# EAGLE design DasAltimeter V0.41 (EAGLE 9.5.2)
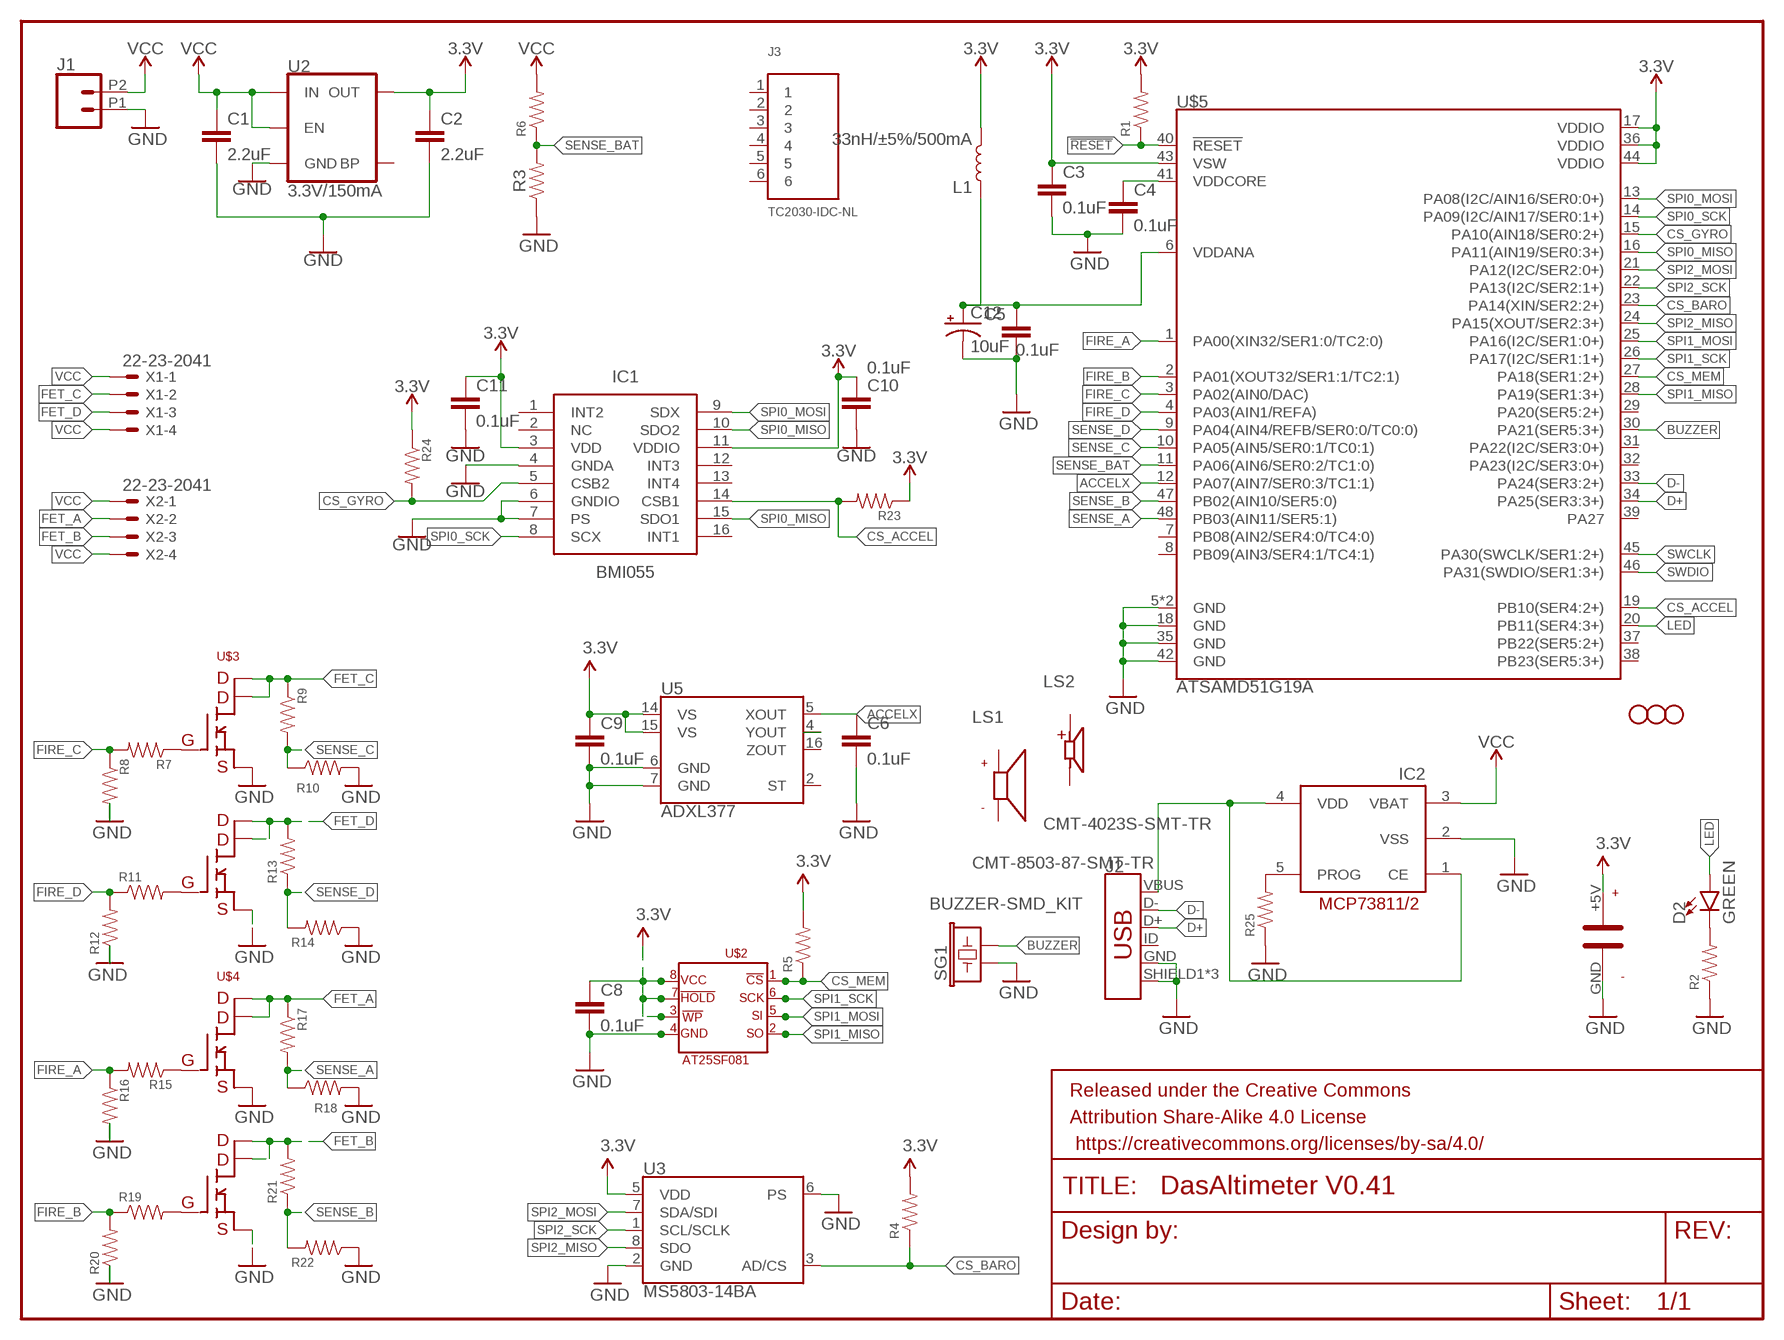
[diagram p0: schematic, sheet 1]

## Parts
C1  2.2uF  2.2UF-0603-10V-20%  [0603]
C2  2.2uF  2.2UF-0603-10V-20%  [0603]
C3  0.1uF  0.1UF-0402-16V-10%  [0402]
C4  0.1uF  0.1UF-0402-16V-10%  [0402]
C5  0.1uF  0.1UF-0402-16V-10%  [0402]
C6  0.1uF  0.1UF-0402-16V-10%  [0402]
C8  0.1uF  0.1UF-0402-16V-10%  [0402]
C9  0.1uF  0.1UF-0402-16V-10%  [0402]
C10  0.1uF  0.1UF-0402-16V-10%  [0402]
C11  0.1uF  0.1UF-0402-16V-10%  [0402]
C12  10uF  10UF-POLAR-0603-6.3V-20%(TANT)  [0603-POLAR]
D2  GREEN  LED-GREEN1206  [LED-1206]
FRAME1  FRAME-LETTERNO_PACKAGE  [DUMMY]
H1  STAND-OFFTIGHT  [STAND-OFF-TIGHT]
H2  STAND-OFFTIGHT  [STAND-OFF-TIGHT]
H3  STAND-OFFTIGHT  [STAND-OFF-TIGHT]
IC1  BMI055  [BMI055]
IC2  MCP73811/2  [SOT23-5L]
J1  CONN_022.54MM_SCREWTERM  [1X02_2.54_SCREWTERM]
J2  USB_MICRO-BREDUCED_PASTE  [USB-B-MICRO-SMD_RED_PASTE]
J3  TC2030-IDC-NL  [TAG_TC2030-IDC-NL]
L1  33nH/±5%/500mA  INDUCTOR-0603-33NH  [0603]
LS1  CMT-8503-87-SMT-TR  [XDCR_CMT-8503-87-SMT-TR]
LS2  CMT-4023S-SMT-TR  [CUI_CMT-4023S-SMT-TR]
R1  RESISTOR0402  [0402]
R2  RESISTOR0402  [0402]
R3  RESISTOR0402  [0402]
R4  RESISTOR0402  [0402]
R5  RESISTOR0402  [0402]
R6  RESISTOR0402  [0402]
R7  RESISTOR0402  [0402]
R8  RESISTOR0402  [0402]
R9  RESISTOR0402  [0402]
R10  RESISTOR0402  [0402]
R11  RESISTOR0402  [0402]
R12  RESISTOR0402  [0402]
R13  RESISTOR0402  [0402]
R14  RESISTOR0402  [0402]
R15  RESISTOR0402  [0402]
R16  RESISTOR0402  [0402]
R17  RESISTOR0402  [0402]
R18  RESISTOR0402  [0402]
R19  RESISTOR0402  [0402]
R20  RESISTOR0402  [0402]
R21  RESISTOR0402  [0402]
R22  RESISTOR0402  [0402]
R23  RESISTOR0402  [0402]
R24  RESISTOR0402  [0402]
R25  RESISTOR0402  [0402]
SG1  BUZZER-SMD_KIT  [BUZZER-CCV-KIT]
U2  3.3V/150mA  V_REG_MIC52053.3V  [SOT23-5]
U3  MS5803-14BA  [MS5803]
U5  ADXL377  [LFCSP-16-3X3]
U$1  PB-5R0H104-R  [PB-5R0H104-R]
U$2  AT25SF081  [AT25SF081]
U$3  SI7232DN  [SI7232DN]
U$4  SI7232DN  [SI7232DN]
U$5  ATSAMD51G19A  [QFN-48]
X1  22-23-2041  [22-23-2041]
X2  22-23-2041  [22-23-2041]

## Nets
3.3V: C2.1 C3.1 C8.1 C9.1 C10.1 C11.1 IC1.3(VDD) IC1.11(VDDIO) L1.2 R1.2 R4.2 R5.2 R23.1 R24.1 U2.5(OUT) U3.5(VDD) U5.14(VS) U5.15(VS) U$1.+5V U$2.!HOLD U$2.!WP U$2.VCC U$5.17(VDDIO) U$5.36(VDDIO) U$5.43(VSW) U$5.44(VDDIO)
!RESET: R1.1 U$5.40(!RESET!)
ACCELX: C6.1 U5.5(XOUT) U$5.12(PA07(AIN7/SER0:3/TC1:1))
BUZZER: SG1.- U$5.30(PA21(SER5:3+))
CS_ACCEL: IC1.14(CSB1) R23.2 U$5.19(PB10(SER4:2+))
CS_BARO: R4.1 U3.3(AD/CS) U$5.23(PA14(XIN/SER2:2+))
CS_GYRO: IC1.5(CSB2) R24.2 U$5.15(PA10(AIN18/SER0:2+))
CS_MEM: R5.1 U$2.!CS U$5.27(PA18(SER1:2+))
D+: J2.D+ U$5.34(PA25(SER3:3+))
D-: J2.D- U$5.33(PA24(SER3:2+))
FET_A: R17.1 U$4.7(PIN7) U$4.8(PIN8) U$4.9(PIN8) X2.2
FET_B: R21.2 U$4.5(PIN5) U$4.6(PIN6) U$4.10(PIN5) X2.3
FET_C: R9.1 U$3.7(PIN7) U$3.8(PIN8) U$3.9(PIN8) X1.2
FET_D: R13.2 U$3.5(PIN5) U$3.6(PIN6) U$3.10(PIN5) X1.3
FIRE_A: R15.2 R16.1 U$5.1(PA00(XIN32/SER1:0/TC2:0))
FIRE_B: R19.1 R20.2 U$5.2(PA01(XOUT32/SER1:1/TC2:1))
FIRE_C: R7.2 R8.1 U$5.3(PA02(AIN0/DAC))
FIRE_D: R11.1 R12.2 U$5.4(PA03(AIN1/REFA))
GND: C1.2 C2.2 C3.2 C4.2 C5.2 C6.2 C8.2 C9.2 C10.2 C11.2 C12.- IC1.4(GNDA) IC1.6(GNDIO) IC1.7(PS) IC2.2(VSS) J1.P1 J2.GND J2.SHIELD1(SHIELD) J2.SHIELD2(SHIELD) J2.SHIELD3(SHIELD) R2.1 R3.1 R8.2 R10.2 R12.1 R14.1 R16.2 R18.2 R20.1 R22.1 R25.1 SG1.+ U2.2(GND) U3.2(GND) U3.6(PS) U5.6(GND) U5.7(GND) U$1.GND U$2.GND U$3.1(PIN1) U$3.3(PIN3) U$4.1(PIN1) U$4.3(PIN3) U$5.5(GND) U$5.18(GND) U$5.35(GND) U$5.42(GND) U$5.EP(GND)
LED: D2.A U$5.20(PB11(SER4:3+))
N$1: R7.1 U$3.2(PIN2)
N$2: U5.4(YOUT)
N$3: C4.1 U$5.41(VDDCORE)
N$4: C5.1 C12.+ L1.1 U$5.6(VDDANA)
N$5: IC2.1(CE) IC2.4(VDD) J2.VBUS
N$6: IC2.5(PROG) R25.2
N$8: R11.2 U$3.4(PIN4)
N$12: R15.1 U$4.2(PIN2)
N$13: R19.2 U$4.4(PIN4)
N$29: D2.C R2.2
SENSE_A: R17.2 R18.1 U$5.48(PB03(AIN11/SER5:1))
SENSE_B: R21.1 R22.2 U$5.47(PB02(AIN10/SER5:0))
SENSE_BAT: R3.2 R6.1 U$5.11(PA06(AIN6/SER0:2/TC1:0))
SENSE_C: R9.2 R10.1 U$5.10(PA05(AIN5/SER0:1/TC0:1))
SENSE_D: R13.1 R14.2 U$5.9(PA04(AIN4/REFB/SER0:0/TC0:0))
SPI0_MISO: IC1.10(SDO2) IC1.15(SDO1) U$5.16(PA11(AIN19/SER0:3+))
SPI0_MOSI: IC1.9(SDX) U$5.13(PA08(I2C/AIN16/SER0:0+))
SPI0_SCK: IC1.8(SCX) U$5.14(PA09(I2C/AIN17/SER0:1+))
SPI1_MISO: U$2.SO U$5.28(PA19(SER1:3+))
SPI1_MOSI: U$2.SI U$5.25(PA16(I2C/SER1:0+))
SPI1_SCK: U$2.SCK U$5.26(PA17(I2C/SER1:1+))
SPI2_MISO: U3.8(SDO) U$5.24(PA15(XOUT/SER2:3+))
SPI2_MOSI: U3.7(SDA/SDI) U$5.21(PA12(I2C/SER2:0+))
SPI2_SCK: U3.1(SCL/SCLK) U$5.22(PA13(I2C/SER2:1+))
SWCLK: U$5.45(PA30(SWCLK/SER1:2+))
SWDIO: U$5.46(PA31(SWDIO/SER1:3+))
VCC: C1.1 IC2.3(VBAT) J1.P2 R6.2 U2.1(IN) U2.3(EN) X1.1 X1.4 X2.1 X2.4
Unconnected: IC1.1(INT2) IC1.2(NC) IC1.12(INT3) IC1.13(INT4) IC1.16(INT1) J2.ID J3.1 J3.2 J3.3 J3.4 J3.5 J3.6 LS1.N LS1.P LS2.N LS2.P U2.4(BP) U5.2(ST) U5.16(ZOUT) U$5.7(PB08(AIN2/SER4:0/TC4:0)) U$5.8(PB09(AIN3/SER4:1/TC4:1)) U$5.29(PA20(SER5:2+)) U$5.31(PA22(I2C/SER3:0+)) U$5.32(PA23(I2C/SER3:0+)) U$5.37(PB22(SER5:2+)) U$5.38(PB23(SER5:3+)) U$5.39(PA27)

## Library data of the parts
C1 C2 = SparkFun-Capacitors:2.2UF: 2.2µF ceramic capacitors A capacitor is a passive two-terminal electrical component used to store electrical energy temporarily in an electric field.; PROD_ID: CAP-07888
C3-C6 C8-C11 = SparkFun-Capacitors:0.1UF: 0.1µF ceramic capacitors A capacitor is a passive two-terminal electrical component used to store electrical energy temporarily in an electric field.; PROD_ID: CAP-12416
C12 = SparkFun-Capacitors:10UF-POLAR: 10.0µF polarized capacitors A capacitor is a passive two-terminal electrical component used to store electrical energy temporarily in an electric field.; PROD_ID: CAP-13210
D2 = SparkFun-LED:LED-GREEN: Green SMD LED Used in manufacturing of various products at SparkFun Packages: 0603 - SMD 0603 package [Product Link] <http://www.futureelectronics.com/en/technologies/semiconductors/optoelectronics/leds/Pages/9894312-LTST-C190GKT.aspx?CrossPart=HSMG-C190&IM=0> LilyPad 1206 - SMD1206 LilyPad package [Product Link] <http://www.futureelectronics.com/en/Technologies/Product.aspx?ProductID=IN150NGHARVATEKCORPORATION2049943&IM=0> 1206 - SMD1206 package [Product Link] <http://www.futureelectronics.com/en/technologies/semiconductors/optoelectronics/leds/Pages/8315665-LTST-C150KGKT.aspx?IM=0> 1206 Bottom Mount -SMD 1206 Bottom Mount [Product Link] <http://www.digikey.com/product-detail/en/lite-on-inc/LTST-C230KGKT/160-1456-1-ND/386854> SparkFun Products: Pro Mini 328 -5V <https://www.sparkfun.com/products/821> RedBoard <https://www.sparkfun.com/products/12757> MP3 Trigger <https://www.sparkfun.com/products/13720> Makey Makey <https://www.sparkfun.com/products/11076>; PROD_ID: DIO-00862
FRAME1 = SparkFun-Aesthetics:FRAME-LETTER: Schematic Frame - Letter Standard 8.5x11 US Letter frame; DESIGNER: Nobody; VERSION: v01
H1-H3 = SparkFun-Hardware:STAND-OFF: Stand Off Drill holes for mechanically mounting via screws, standoffs, etc. Note: Use the keepout ring to avoid running the screw head into surrounding components. Variant Overviews STAND-OFF - Mechanical footprint for a #4 phillips button head screw. STAND-OFF-TIGHT - Mechanical footprint for a #4 phillips button head screw, Example SparkFun Products Screw - Phillips Head (1/4", 4-40, 10 pack) <https://www.sparkfun.com/products/10453> (PRT-10453) Screw - Phillips Head (1/2", 4-40, 10 pack) <https://www.sparkfun.com/products/10452> (PRT-10452) Screw - Phillips Head (3/4", 4-40, 10 pack) <https://www.sparkfun.com/products/10451> (PRT-10451) Screw - Phillips Head (1", 4-40, 10 pack) <https://www.sparkfun.com/products/10450> (PRT-10450)
IC1 = BMI055:BMI055: IMUs - Inertial Measurement Units 6-Axis Inertia 3x4.5mm LGA-16 <https://componentsearchengine.com/Images/1/BMI055.jpg> Source: Datasheet <https://ae-bst.resource.bosch.com/media/_tech/media/datasheets/BST-BMI055-DS000-08.pdf>; DESCRIPTION: IMUs - Inertial Measurement Units 6-Axis Inertia 3x4.5mm LGA-16; HEIGHT: mm; MANUFACTURER_NAME: Bosch Sensortec; MANUFACTURER_PART_NUMBER: BMI055; SUPPLIER_NAME: RS
IC2 = adafruit:MCP73811/2: MCP73811 and MCP73812 Simple, Miniature Single-Cell, Fully Integrated Li-Ion / Li-Polymer Charge Management Controllers SOT-23-5 package, no indicator LED but with adjustable current, small and very inexpensive
J1 = SparkFun-Connectors:CONN_02: Multi connection point. Often used as Generic Header-pin footprint for 0.1 inch spaced/style header connections On any of the 0.1 inch spaced packages, you can populate with these: Break Away Headers - Straight <https://www.sparkfun.com/products/116> (PRT-00116) Break Away Male Headers - Right Angle <https://www.sparkfun.com/products/553> (PRT-00553) Female Headers <https://www.sparkfun.com/products/115> (PRT-00115) Break Away Headers - Machine Pin <https://www.sparkfun.com/products/117> (PRT-00117) Break Away Female Headers - Swiss Machine Pin <https://www.sparkfun.com/products/743> (PRT-00743) For SCREWTERMINALS and SPRING TERMINALS visit here: Screw Terimnals on SparkFun.com <https://www.sparkfun.com/search/results?term=Screw+Terminals> (5mm/3.5mm/2.54mm spacing) This device is also useful as a general connection point to wire up your design to another part of your project. Our various solder wires solder well into these plated through hole pads. Hook-Up Wire - Assortment (Stranded, 22 AWG) <https://www.sparkfun.com/products/11375> (PRT-11375) Hook-Up Wire - Assortment (Solid Core, 22 AWG) <https://www.sparkfun.com/products/11367> (PRT-11367) View the entire wire category on our website here <https://www.sparkfun.com/categories/141> Special notes: Molex polarized connector foot print use with: PRT-08233 with associated crimp pins and housings. 2.54_SCREWTERM for use with PRT-10571. 3.5mm Screw Terminal footprints for PRT-08084 5mm Screw Terminal footprints for use with PRT-08432
J2 = SparkFun-Connectors:USB_MICRO-B: USB Type Micro-B Connector Male/female and PTH/SMT variants SparkFun Products: SparkFun microB USB Breakout <https://www.sparkfun.com/products/12035> SparkFun USB microB Plug Breakout <https://www.sparkfun.com/products/10031> SparkFun ESP8266 Thing <https://www.sparkfun.com/products/13231>; PROD_ID: CONN-11752
J3 = TC2030-IDC-NL:TC2030-IDC-NL: CABLE ADAPTER 6 POS; AVAILABILITY: Unavailable; DESCRIPTION: 6-PIN PLUG-OF-NAILS CABLE 6; MF: Tag-Connect; MP: TC2030-IDC-NL; PACKAGE: Package; PRICE: None
L1 = SparkFun-Coils:INDUCTOR: Inductors Resist changes in electrical current. Basically a coil of wire. SparkFun Products: SparkFun Load Cell Amplifier - HX711 <https://www.sparkfun.com/products/13879> IOIO-OTG - V2.2 <https://www.sparkfun.com/products/13613>; PROD_ID: NDUC-07874
LS1 = CMT-8503-87-SMT-TR:CMT-8503-87-SMT-TR: CMT-8503-87-SMT-TR; MANUFACTURER: CUI Inc.; MAXIMUM_PACKAGE_HEIGHT: 3.00mm; PARTREV: 1.0; STANDARD: Manufacturer Recommendations
LS2 = CMT-4023S-SMT-TR:CMT-4023S-SMT-TR: 4 mm, 3 Vo-p, 70 dB, Surface Mount (SMT), Magnetic Audio Transducer Buzzer; MANUFACTURER: CUI INC; PARTREV: 1.0; STANDARD: Manufacturer recommendations
R1-R25 = SparkFun-Resistors:RESISTOR: Generic Resistor Package
SG1 = SparkFun-Electromechanical:BUZZER: Buzzer Small round buzzers that operate around the audible 2kHz range. You can use these as speakers to create simple music or user interfaces. Variant Overview: PTH - Mini Speaker - PC Mount 12mm 2.048kHz <https://www.sparkfun.com/products/7950> PTH_KIT - Mini Speaker - PC Mount 12mm 2.048kHz <https://www.sparkfun.com/products/7950> KIT simplifies soldering by adding stop mask to one side of the pads. PTH_NO_SILK - Mini Speaker - PC Mount 12mm 2.048kHz <https://www.sparkfun.com/products/7950> No silkscreen indicator of buzzer outline. PTH_KIT_NO_SILK - Mini Speaker - PC Mount 12mm 2.048kHz <https://www.sparkfun.com/products/7950> KIT package w/o silkscreen SMD - Buzzer Audio Magnetic (CCV-084B16) SMD buzzer used on, e.g. the LilyPad Buzzer <https://www.sparkfun.com/products/8463> and RFID USB Reader <https://www.sparkfun.com/products/9963>. SMD_KIT - Buzzer Audio Magnetic (CCV-084B16) SMD Buzzer with elongated pins to make soldering easier. Used on the SparkFun Simon Says - Surface Mount Soldering Kit <https://www.sparkfun.com/products/10935>.; PROD_ID: COMP-08568
U2 = SparkFun-IC-Power:V_REG_MIC5205: V_REG MIC5205 Standard 3.3V, 5V, and Adjustable 150mA LDO voltage regulator in SOT-23 layout. Micrel part MIC5205. BP (by-pass) pin is used to lower output noise with 470pF cap, may be left open. On the adjustable version BP is used to set output.; PROD_ID: VREG-00822
U3 = SparkFun-Sensors:MS5803-14BA: Measurement Specialties MS5803_14BA Pressure (Depth) Sensor The MS5803-14BA is a new generation of high resolution pressure sensors with SPI and I2C bus interface. It is optimized for depth measurement systems with a water depth resolution of 1cm and below. The sensor module includes a high linear pressure sensor and an ultra low power 24 bit ΔΣ ADC with internal factory calibrated coefficients. It provides a precise digital 24 Bit pressure and temperature value and different operation modes that allow the user to optimize for conversion speed and current consumption. Datasheet <https://cdn.sparkfun.com/datasheets/Sensors/Weather/ms5803_14ba.pdf> SparkFun Products SparkFun Pressure Sensor Breakout - MS5803-14BA <https://www.sparkfun.com/products/12909> (SEN-12909); PROD_ID: IC-12111
U5 = SparkFun-Sensors:ADXL377: Analog Devices ADXL377 Low Power 3-Axis ±200 g Accelerometer with Analog Output The ADXL377 is a small, thin, low power, complete 3-axis accelerometer with signal conditioned voltage outputs. The ADXL377 measures acceleration resulting from motion, shock, or vibration with a typical full-scale range of ±200g. Datasheet <https://cdn.sparkfun.com/datasheets/Sensors/Accelerometers/ADXL377.pdf> SparkFun Products SparkFun Triple Axis Accelerometer Breakout - ADXL377 <https://www.sparkfun.com/products/12803> (SEN-12803); PROD_ID: IC-12027
U$1 = SaL-lib1:PB-5R0H104-R
U$2 = SaL-lib1:AT25SF081: AT25SF081 - 8M memory smd
U$3 U$4 = SaL-lib1:SI7232DN: SI7232DN dual
U$5 = SparkFun-IC-Microcontroller:ATSAMD51G19A
X1 X2 = con-molex:22-23-2041: .100" (2.54mm) Center Header - 4 Pin; MF: MOLEX; MPN: 22-23-2041; OC_FARNELL: 1462920; OC_NEWARK: 38C0355

## Board
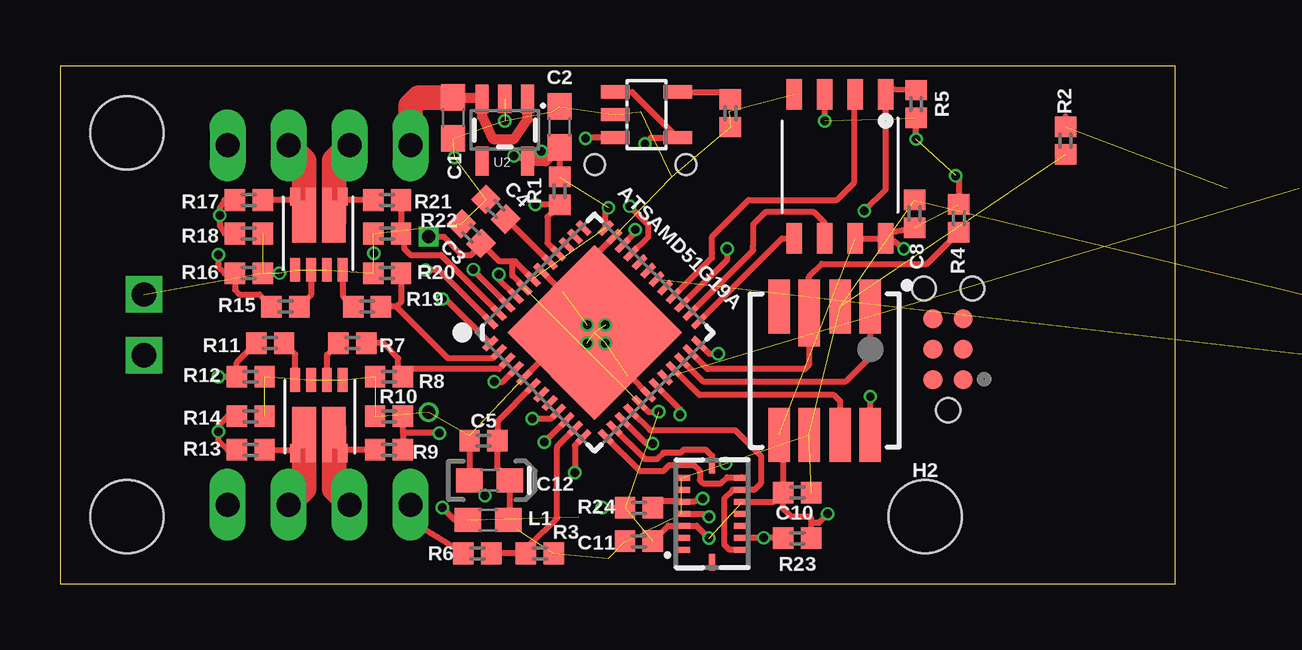
[diagram p1: board, top side]
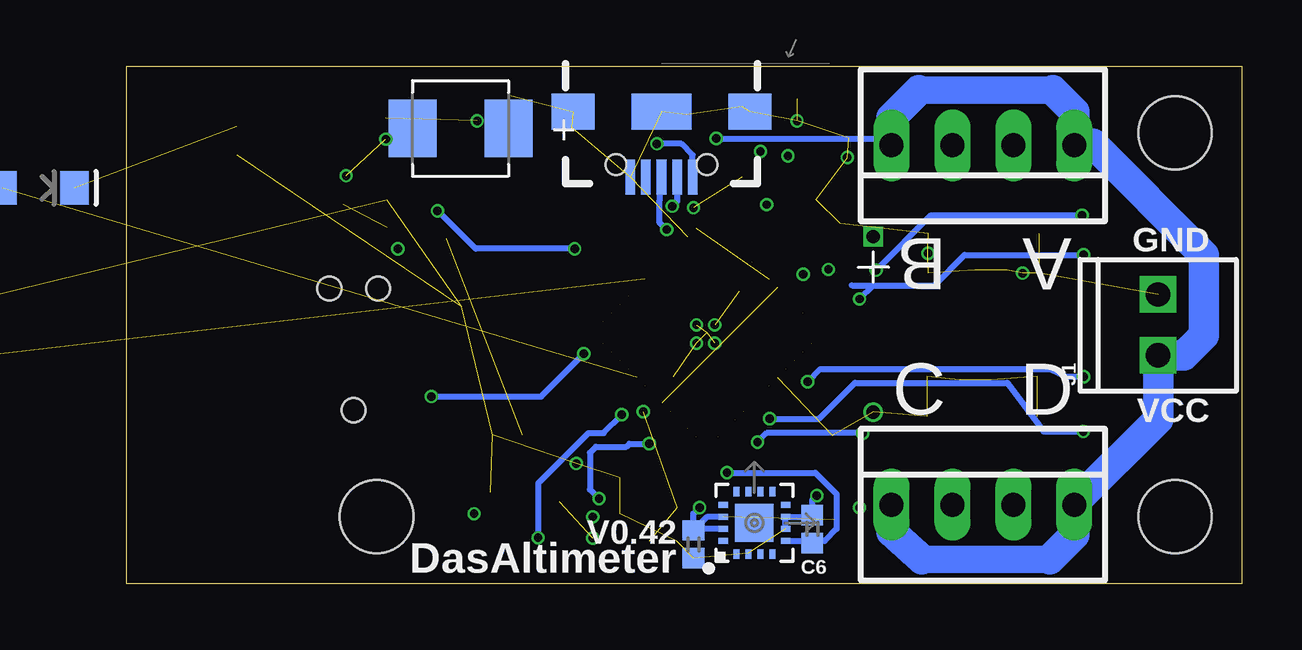
[diagram p2: board, bottom side, seen from below]

Size 46.48 x 21.59 mm. Coordinates in mm from the lower left corner, seen from the top.
Outline: 0,0 46.48,0 46.48,21.59 0,21.59 0,0
Copper layers (1*2*15*16): Top 0.035559375mm / dielectric 0.17018125mm / Route2 0.01778125mm / dielectric 47mil / Route15 0.01778125mm / dielectric 0.17018125mm / Bottom 0.035559375mm
Design rules "oshpark-4layer *": minimum track width 5mil, minimum drill 10mil, track to track 5mil, track to pad 5mil, pad to pad 5mil, via to via 5mil, smd to smd 5mil, copper to edge 15mil, drill to drill 6mil, minimum pad ring 4mil, minimum via ring 4mil, stop-mask expansion 2.5mil, vias tented up to drill 30mil, thermal gap 10mil

### Footprints (pad centres in the part's own frame; a part is rotated, then mirrored left to right if it is on the bottom)
0603 = smd 1.1 x 1: 1 -0.85,0; 2 0.85,0
0402 = smd 0.85 x 0.9: 1 -0.58,0; 2 0.58,0
0603-POLAR = smd 1.1 x 1: + 0.85,0; - -0.85,0
LED-1206 = smd 1.2 x 1.4: A -1.5,0; C 1.5,0
STAND-OFF-TIGHT = hole 3.048: 0,0
BMI055 = smd 0.675 x 0.25: 1 1.262,1.5; 2 1.262,1; 3 1.262,0.5; 4 1.262,0; 5 1.262,-0.5; 6 1.262,-1; 7 1.262,-1.5; 9 -1.262,-1.5; 10 -1.262,-1; 11 -1.262,-0.5; 12 -1.262,0; 13 -1.262,0.5; 14 -1.262,1; 15 -1.262,1.5 | smd 0.25 x 0.675: 8 0,-2.013; 16 0,2.013
SOT23-5L = smd 0.55 x 1.2: 1 -0.95,-1.3; 2 0,-1.3; 3 0.95,-1.3; 4 0.95,1.3; 5 -0.95,1.3
1X02_2.54_SCREWTERM = drill 1.016 square: P1 2.54,0; P2 0,0
USB-B-MICRO-SMD_RED_PASTE = smd 1.45 x 0.4: D+ 2.725,0; D- 2.725,0.65; GND 2.725,-1.3; ID 2.725,-0.65; VBUS 2.725,1.3 | smd 1.5 x 1.8: SHIELD1 0,3.685; SHIELD2 0,-3.685 | smd 1.5 x 2.5: SHIELD3 0,0 | hole 0.85: 2.2,1.9; 2.2,-1.9
TAG_TC2030-IDC-NL = smd 0.787 x 0.787: 1 -1.27,-0.635; 2 -1.27,0.635; 3 0,-0.635; 4 0,0.635; 5 1.27,-0.635; 6 1.27,0.635 | hole 0.991: -2.54,0; 2.54,1.016; 2.54,-1.016
XDCR_CMT-8503-87-SMT-TR = smd 2.5 x 2.5: 1 3.5,3.5; 2 3.5,-3.5; N -3.5,-3.5; P -3.5,3.5
CUI_CMT-4023S-SMT-TR = smd 2 x 2.4: N -2,0; P 2,0
BUZZER-CCV-KIT = smd 3.5 x 2: + 4.15,0; - -4.15,0 | hole 0.8: -3.9,-2.25; 2.25,3.9
SOT23-5 = smd 0.55 x 1.2: 1 -0.95,-1.3; 2 0,-1.3; 3 0.95,-1.3; 4 0.95,1.3; 5 -0.95,1.3
MS5803 = smd 2.25 x 0.9: 1 -2.675,1.9; 2 -2.675,0.65; 4 -2.675,-1.9; 5 2.675,-1.9; 6 2.675,-0.65; 7 2.675,0.65; 8 2.675,1.9 | smd 2.8 x 0.9: 3 -2.4,-0.65
LFCSP-16-3X3 = smd 0.4 x 0.25: 1 -1.3,0.75; 2 -1.3,0.25; 3 -1.3,-0.25; 4 -1.3,-0.75; 9 1.3,-0.75; 10 1.3,-0.25; 11 1.3,0.25; 12 1.3,0.75 | smd 0.25 x 0.4: 5 -0.75,-1.3; 6 -0.25,-1.3; 7 0.25,-1.3; 8 0.75,-1.3; 13 0.75,1.3; 14 0.25,1.3; 15 -0.25,1.3; 16 -0.75,1.3 | smd 1.6 x 1.6: EXP 0,0
PB-5R0H104-R = drill 0.55 square: +5V 0,0 | drill 0.55: GND 0,7.32
AT25SF081 = smd 1.27 x 0.635: !CS -3,2.54; !HOLD 3,1.27; !WP -3,0; GND -3,-1.27; SCK 3,0; SI 3,-1.27; SO -3,1.27; VCC 3,2.54
SI7232DN = smd 0.991 x 0.406: 1 -1.13,0.991; 2 -1.13,0.33; 3 -1.13,-0.33; 4 -1.13,-0.991 | smd 0.762 x 0.406: 5 1.918,-0.991; 6 1.918,-0.33; 7 1.918,0.33; 8 1.918,0.991 | smd 1.727 x 0.991: 9 0.864,0.622; 10 0.864,-0.622
QFN-48 = smd 0.7 x 0.25: 1 -3.4,2.75; 2 -3.4,2.25; 3 -3.4,1.75; 4 -3.4,1.25; 5 -3.4,0.75; 6 -3.4,0.25; 7 -3.4,-0.25; 8 -3.4,-0.75; 9 -3.4,-1.25; 10 -3.4,-1.75; 11 -3.4,-2.25; 12 -3.4,-2.75; 25 3.4,-2.75; 26 3.4,-2.25; 27 3.4,-1.75; 28 3.4,-1.25; 29 3.4,-0.75; 30 3.4,-0.25; 31 3.4,0.25; 32 3.4,0.75; 33 3.4,1.25; 34 3.4,1.75; 35 3.4,2.25; 36 3.4,2.75 | smd 0.25 x 0.7: 13 -2.75,-3.4; 14 -2.25,-3.4; 15 -1.75,-3.4; 16 -1.25,-3.4; 17 -0.75,-3.4; 18 -0.25,-3.4; 19 0.25,-3.4; 20 0.75,-3.4; 21 1.25,-3.4; 22 1.75,-3.4; 23 2.25,-3.4; 24 2.75,-3.4; 37 2.75,3.4; 38 2.25,3.4; 39 1.75,3.4; 40 1.25,3.4; 41 0.75,3.4; 42 0.25,3.4; 43 -0.25,3.4; 44 -0.75,3.4; 45 -1.25,3.4; 46 -1.75,3.4; 47 -2.25,3.4; 48 -2.75,3.4 | smd 5.15 x 5.15: EP 0,0
22-23-2041 = drill 1 long: 1 -3.81,0; 2 -1.27,0; 3 1.27,0; 4 3.81,0

### Placement (x,y rotation side)
C1  16.38,19.43 270 top
C2  20.83,19.05 90 top
C3  17.14,14.61 135 top
C4  18.16,15.62 135 top
C5  17.65,5.97 180 top
C6  17.91,2.29 90 bottom
C8  35.62,15.43 90 top
C9  22.86,1.65 270 bottom
C10  30.73,3.81 0 top
C11  24.13,1.78 180 top
C12  17.91,4.32 0 top
D2  50.16,16.51 0 bottom
FRAME1  -21.34,51.05 0 top  (outside the outline)
H1  2.79,18.8 0 top
H2  36.07,2.79 0 top
H3  2.79,2.79 0 top
IC1  27.18,2.92 180 top
IC2  24.45,19.56 270 top
J1  3.49,9.53 90 bottom
J2  24.19,19.68 270 bottom
J3  37.02,9.78 90 top
L1  17.84,2.67 180 top
LS1  32,35.81 0 top  (outside the outline)
LS2  32.58,18.99 0 bottom
R1  20.83,16.38 90 top
R2  41.91,18.48 90 top
R3  20,1.27 180 top
R4  37.46,15.24 90 top
R5  35.69,20 270 top
R6  17.4,1.27 180 top
R7  12.19,10.03 0 top
R8  13.72,8.64 180 top
R9  13.72,5.59 0 top
R10  13.72,6.98 180 top
R11  8.76,10.03 0 top
R12  7.95,8.64 180 top
R13  7.95,5.59 0 top
R14  7.95,6.98 180 top
R15  9.4,11.56 180 top
R16  7.87,12.95 0 top
R17  7.87,16 180 top
R18  7.87,14.61 0 top
R19  12.8,11.56 180 top
R20  13.64,12.95 0 top
R21  13.64,16 180 top
R22  13.64,14.61 0 top
R23  30.73,1.91 180 top
R24  24.13,3.17 0 top
R25  27.94,19.62 90 top
SG1  59.69,9.14 180 bottom  (outside the outline)
U2  18.54,18.92 180 top
U3  31.88,8.89 270 top
U5  20.32,2.54 90 bottom
U$1  15.37,14.48 180 bottom
U$2  31.88,17.4 270 top
U$3  10.79,7.37 270 top
U$4  10.79,14.22 90 top
U$5  22.29,10.48 45 top
X1  10.79,3.3 0 bottom
X2  10.79,18.29 180 bottom

### Tracks (layer width: path | path; a pad name or v marks a point on that pad's centre or on a via)
3.3V  (via drill 0.35)  (14 unrouted)
  Top 0.254: U$2.VCC 34.68,14.66 C8.1 | U$2.!HOLD U$2.VCC | C11.1 25.35,2.42 IC1.3 26.54,2.42 v27.05,1.91 | IC1.11 29.77,3.42 30.13,3.78 | 30.13,3.78 C10.1 30.15,6.04 U3.5 | R23.1 31.31,2.54 | 31.31,2.54 31.31,2.72 31.24,2.79 30.48,2.79 30.13,3.15 30.13,3.78 | 17.55,14.13 C3.1 | U$1.+5V 16,14.48 16.76,13.72 17.14,13.72 17.55,14.13 | v32,2.92 31.62,2.54 31.31,2.54 | v35.69,18.54 R5.2 | v31.88,19.3 U$2.!WP | v18.92,17.84 19.02,17.75 19.37,17.75 U2.5 19.9,18.03 v20.07,18.03 | v37.34,17.02 37.46,16.89 R4.2 | v35.18,13.97 34.62,14.4 U$2.VCC | R24.1 v22.61,3.17 | L1.2 16.45,2.67 v15.94,3.17 | 17.55,14.13 17.64,14.13 18.33,13.44 18.86,13.44 | U$5.17 24.53,7.18 v24.96,7.18 | U$5.36 22.75,15.57 v22.86,15.68 | U$5.43 18.97,13.44 18.86,13.44 | U$5.44 18.86,12.85 18.86,13.44 | C2.1 R1.2
  Top 0.406: C2.1 20.25,17.62 U2.5
  Bottom 0.254: U5.15 22.8,2.29 | 22.8,2.29 C9.1 22.86,2.92 v22.61,3.17 | U5.14 22.3,2.79 22.8,2.29
!RESET  (via drill 0.35)
  Top 0.254: v19.81,15.81 v19.82,15.8 R1.1 20.32,15.29 20.32,14.21 U$5.40
  Bottom 0.254: v19.81,15.81 19.68,15.81
ACCELX  (via drill 0.35)  (1 unrouted)
  Top 0.254: U$5.12 21.46,5.76 v21.46,4.63
  Bottom 0.254: U5.5 17.63,1.79 | 17.63,1.79 C6.1 | v21.46,4.63 17.78,4.63 16.89,3.75 16.89,2.29 17.39,1.79 17.63,1.79
BUZZER  (1 unrouted)
  Top 0.254: U$5.30
CS_ACCEL  (via drill 0.35)  (1 unrouted)
  Top 0.254: R23.2 30.17,1.92 v29.34,1.92 IC1.14 | U$5.19 25.84,7.28 v25.84,7.05
  Bottom 0.254: v29.34,1.92 29.34,4.19 27.24,6.29 26.61,6.29 v25.84,7.05
CS_BARO  (1 unrouted)
  Top 0.254: 31.23,10.4 U3.3 | U3.3 31.23,12.81 31.75,13.34 36.14,13.34 R4.1 | U3.3 31.23,9.13 31.05,8.95 26.99,8.95 U$5.23
CS_GYRO  (via drill 0.35)
  Top 0.254: v26.8,3.56 26.42,3.42 IC1.5 25.09,3.43 R24.2 | U$5.15 24.45,5.84 v24.7,5.84 | U$5.15
  Bottom 0.254: v26.8,3.56 27.18,3.94 27.18,5.46 26.92,5.71 25.65,5.71 25.53,5.84 v24.7,5.84
CS_MEM  (via drill 0.35)  (1 unrouted)
  Top 0.254: R5.1 34.41,20.65 U$2.!CS 34.42,16.45 v33.53,15.56 | v27.81,13.97 27.81,13.72 27.81,13.53 U$5.27
  Bottom 0.254: v27.81,13.97 31.94,13.97 v33.53,15.56
D+  (via drill 0.35)
  Top 0.254: U$5.34 23.98,14.64 v23.98,14.77
  Bottom 0.254: J2.D+ 24.26,16.9 24.26,15.99 24.28,15.97 24.28,15.07 v23.98,14.77
D-  (via drill 0.35)
  Top 0.254: v23.75,15.75 24.51,14.99 24.51,14.47 U$5.33
  Bottom 0.254: J2.D- 23.54,15.95 v23.75,15.75
FET_A
  Top 0.254: R17.1 9.67,16 U$4.8 10.17,16.51 10.17,16.43 U$4.7
  Top 1.016: X2.2 10.17,17.64 10.17,16.51 U$4.9
FET_B
  Top 0.254: R21.2 11.93,16 U$4.5 11.42,16.51 11.12,16.22 U$4.6
  Top 1.016: U$4.10 11.42,16.51 11.42,17.64 X2.3
FET_C
  Top 0.254: R9.1 11.93,5.59 U$3.8 11.43,5.45 | U$3.7 11.43,5.45 | U$3.9 11.42,5.46 11.43,5.45
  Top 1.016: U$3.9 11.42,3.95 X1.2
FET_D
  Top 0.254: R13.2 9.67,5.59 U$3.5 | U$3.5 U$3.6 | U$3.5 9.8,6.13 U$3.10
  Top 1.016: U$3.10 10.17,3.95 X1.3
FIRE_A  (via drill 0.35)  (1 unrouted)
  Top 0.254: R15.2 8.31,12.07 7.49,12.07 7.29,12.26 R16.1 6.86,12.95 6.6,13.21 v6.6,13.72 | U$5.1 16.08,11.88 v15.94,11.88
  Bottom 0.254: v6.6,13.72 11.56,13.72 12.83,12.45 15.37,12.45 | 16.26,12.45 15.37,12.45 | v15.94,11.88 15.37,12.45
FIRE_B  (1 unrouted)
  Top 0.254: 14.02,11.56 R19.1 | U$5.2 18.03,9.4 16.18,9.4 14.02,11.56 | 14.02,11.56 14.22,11.76 R20.2
FIRE_C  (1 unrouted)
  Top 0.254: R8.1 14.1,8.84 14.1,8.95 | 14.1,8.95 14.1,9.4 13.46,10.03 R7.2 | U$5.3 18.29,8.95 14.1,8.95
FIRE_D  (via drill 0.35)  (1 unrouted)
  Top 0.254: R11.1 7.37,9.22 R12.2 v6.6,8.64 | v18.1,8.42 18.46,8.42 18.99,8.96 U$5.4
  Bottom 0.254: 8.13,9.02 7.98,8.94 | 7.98,8.94 R12.2 v6.6,8.64 | 7.98,8.94 17.58,8.94 v18.1,8.42
GND  (via drill 0.35)  (52 unrouted)
  Top 0.254: IC1.4 27.05,2.92 v27.05,2.79 | 17.07,6.2 C5.2 17.07,4.33 C12.- 17.14,4.32 v17.72,3.68 | U$5.18 23.78,8.64 23.69,8.64 | U$5.42 20.93,12.19 20.96,12.19 | U$5.EP 22.1,10.67 | 22.1,10.67 v21.97,10.79 21.84,10.92 21.84,13.21 U$5.35 | U$5.5 21.42,10.67 22.1,10.67 | U$5.18
  Bottom 0.254: U5.6 U5.7 18.24,2.79 C6.2 17.91,3.49 v17.72,3.68
  other vias: 9.14,12.95 13.08,13.78 22.73,10.79 22.73,10.03 21.97,10.03 16.45,17.78 18.54,19.3 27.75,5.02
LED  (1 unrouted)
N$1
  Top 0.254: U$3.2 11.12,9.55 R7.1
N$3  (1 unrouted)
  Top 0.254: 18.54,15.18 C4.1 18.62,15.21 U$5.41
N$4  (1 unrouted)
  Top 0.254: U$5.6 18.23,6.78 C5.1 18.23,4.84 C12.+ 18.76,2.73 L1.1
N$5  (via drill 0.35)
  Top 0.254: IC2.1 23.85,20.51 IC2.4 24.64,18.61 v24.38,18.35
  Bottom 0.254: J2.VBUS 22.89,17.88 23.37,18.35 v24.38,18.35
N$6
  Top 0.254: IC2.5 27.63,20.51 R25.2
N$8
  Top 0.254: U$3.4 9.8,9.57 R11.2
N$12
  Top 0.254: U$4.2 10.46,12.04 R15.1
N$13
  Top 0.254: U$4.4 11.79,11.99 R19.2
N$29  (1 unrouted)
  Top 0.254: R2.2 41.91,19.5
SENSE_A  (via drill 0.35)
  Top 0.254: R17.2 6.86,16 6.66,15.68 v6.66,15.37 6.66,14.93 6.86,14.61 R18.1 | U$5.48 15.8,13.08 v15.24,13.08 | U$5.48
  Bottom 0.254: v15.24,13.08 12.95,15.37 v6.66,15.37
SENSE_B  (1 unrouted)
  Top 0.254: R21.1 R22.2 14.35,14.47 14.35,13.97 14.61,13.72 15.88,13.72 U$5.47
SENSE_BAT
  Top 0.254: R3.2 19.18,1.27 | 19.18,1.27 R6.1 | 19.18,1.27 20.7,2.71 20.7,5.66 20.72,5.69 20.72,5.73 U$5.11 | U$5.11
SENSE_C  (via drill 0.35)  (1 unrouted)
  Top 0.254: 14.3,6.29 R10.1 | 14.3,6.29 R9.2 | v20.19,5.91 U$5.10 | v15.81,6.29 14.3,6.29
  Bottom 0.254: v15.81,6.29 19.81,6.29 v20.19,5.91
SENSE_D  (via drill 0.35)  (1 unrouted)
  Top 0.254: R14.2 6.98,6.98 6.61,6.61 v6.61,6.35 6.6,5.97 6.98,5.59 R13.1 | U$5.9 20.46,6.88 v19.68,6.88
  Bottom 0.254: v6.61,6.35 8.26,6.35 9.78,8.38 16.13,8.38 17.63,6.88 v19.68,6.88
SPI0_MISO  (1 unrouted)
  Top 0.254: IC1.15 27.92,1.42 27.69,1.65 27.69,3.56 28.05,3.92 IC1.10 28.94,3.92 29.21,4.19 29.21,5.33 28.13,6.41 24.59,6.41 U$5.16
SPI0_MOSI  (1 unrouted)
  Top 0.254: IC1.9 28.42,4.45 27.81,4.45 27.56,4.19 26.8,4.19 26.67,4.32 26.67,4.7 26.42,4.95 25.4,4.95 25.15,4.7 24.18,4.7 | 24.18,4.7 | U$5.13 24.18,4.7
SPI0_SCK  (1 unrouted)
  Top 0.254: 24.38,5.21 24.89,5.21 25.15,5.46 25.86,5.46 25.99,5.59 26.92,5.59 27.18,5.33 IC1.8 | U$5.14 24.38,5.21 | 24.38,5.21
SPI1_MISO  (1 unrouted)
  Top 0.254: U$2.SO 33.08,20.46 33.08,16.7 32.38,16 28.7,16 27.18,14.48 27.18,13.78 27.18,13.6 U$5.28
SPI1_MOSI  (1 unrouted)
  Top 0.254: 30.29,14.41 U$2.SI 30.1,14.4 U$5.25
SPI1_SCK  (1 unrouted)
  Top 0.254: U$2.SCK 31.88,15.05 31.43,15.49 29.4,15.49 28.89,14.99 28.89,14.1 28.89,13.9 U$5.26
SPI2_MISO  (via drill 0.35)  (1 unrouted)
  Top 0.254: U3.8 v33.78,7.8 v33.78,7.81 | v27.43,9.59 27.07,9.59 U$5.24
  Bottom 0.254: v33.78,7.81 29.21,7.81 v27.43,9.59
SPI2_MOSI  (1 unrouted)
  Top 0.254: U3.7 32.53,7.61 32.26,7.87 26.66,7.87 U$5.21
SPI2_SCK  (1 unrouted)
  Top 0.254: U$5.22 26.8,8.45 32.77,8.45 33.78,9.46 U3.1
SWCLK  (via drill 0.35)
  Top 0.254: U$5.45 18.29,12.71 v18.29,12.91
SWDIO  (via drill 0.35)
  Top 0.254: U$5.46 17.23,13.06 v17.23,13.11
VCC  (via drill 0.35)
  Top 0.254: R6.2 14.73,2.54 14.61,2.67 X1.1 | IC2.3 21.95,18.61 v21.91,18.57
  Top 0.406: C1.1 17.53,20.28 U2.3 17.59,19.49 18.03,18.54 18.92,18.54 19.49,19.37 U2.1
  Top 1.016: X2.4 14.61,19.94 14.95,20.28 C1.1
  Bottom 0.254: 14.92,18.61 14.88,18.57 | X2.4 14.73,18.41 14.88,18.57 | v21.91,18.57 14.88,18.57
  Bottom 1.143: 7.87,20.57 13.46,20.57 | 8,1.02 13.34,1.02
  Bottom 1.27: 7.87,20.57 6.98,19.68 X2.1 6.29,18.29 6.22,18.35 1.59,13.72 1.59,10.35 2.41,9.53 J1.P2 3.49,6.86 6.98,3.37 X1.4 6.98,2.03 8,1.02 | X2.4 14.61,19.43 13.46,20.57 | 13.34,1.02 14.61,2.16 X1.1

### Text on the board
bNames: GND | A | B | D | C | VCC | V0.42 | DasAltimeter